# Altium schematic sheet LEDs.SchDoc
size Letter; CompanyName: Ploopy Corporation; Organization: Ploopy Corporation; Address1: 137-1140 Burnhamthorpe Road W; Address2: Mississauga; Address3: Ontario; Address4: Canada L5C 0A3; DocumentNumber: 4; Revision: R2.002; SheetNumber: 4; SheetTotal: 9
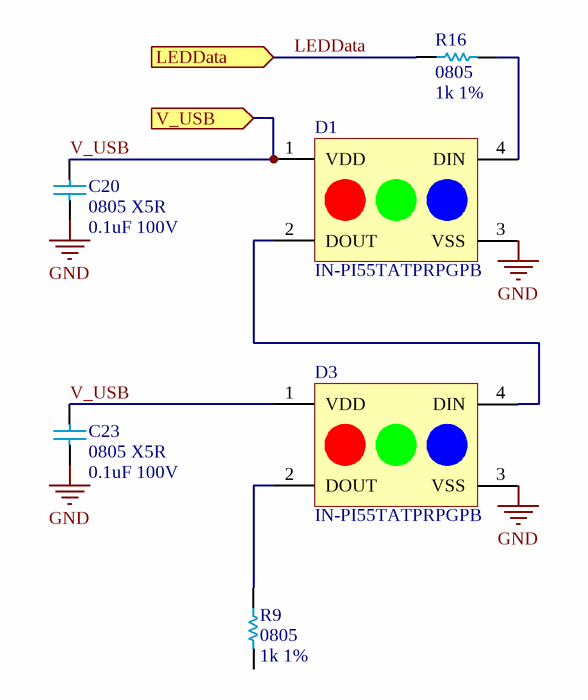
[diagram p0: LEDs.SchDoc]

## Parts
C20  0805 X5R  value 0.1uF 100V  [0805 - TALL]
C23  0805 X5R  value 0.1uF 100V  [0805 - TALL]
D1  IN-PI55TATPRPGPB  [IN-PI55TATPRPGPB]
D3  IN-PI55TATPRPGPB  [IN-PI55TATPRPGPB]
R9  0805  value 1k 1%  [0805]
R16  0805  value 1k 1%  [0805]

## Ports
LEDData (in), V_USB (in)

## Nets
GND: C20.1 C23.1 D1.3(VSS) D3.3(VSS)
LEDData: R16.2 ; port LEDData
V_USB: C20.2 C23.2 D1.1(VDD) D3.1(VDD) ; port V_USB
NetD1_2: D1.2(DOUT) D3.4(DIN)
NetD1_4: D1.4(DIN) R16.1
NetD3_2: D3.2(DOUT) R9.2

Not connected (* = marked no-connect by the designer): R9 1

## Notes on the sheet
- Copyright Ploopy Corporation
- Licensed under the CERN-OHL-S v2
- http://ohwr.org/cernohl
- Title:
- PCB:
- Version:
- Ploopy Corporation
- Mississauga ON L5C 0A3
- 137-1140 Burnhamthorpe Road W
- Date:
- Time:
- Sheet
- of
- Canada

## Library data of the parts
C20 C23 = Cap 0.1uF 100V: 0805, X5R or better; Supplier 1: Digi-Key; Supplier Part Number 1: 1276-6840-2-ND
D1 D3 = IN-PI55TATPRPGPB: ADDRESS LED DISCRETE SERIAL RGB; Supplier 1: Digi-Key; Supplier 2: Arrow; Supplier 3: Mouser; Supplier Part Number 1: 1830-1204-1-ND; Supplier Part Number 2: IN-PI55TATPRPGPB; Supplier Part Number 3: 743-IN-PI55TATPRPGPB
R9 R16 = Res 1k 1% 0805: Chip resistor, 1/8W 100PPM; Supplier 1: Digi-Key; Supplier Part Number 1: RMCF0805FT1K00TR-ND